# EAGLE schematic LED's (EAGLE 9.5.2)
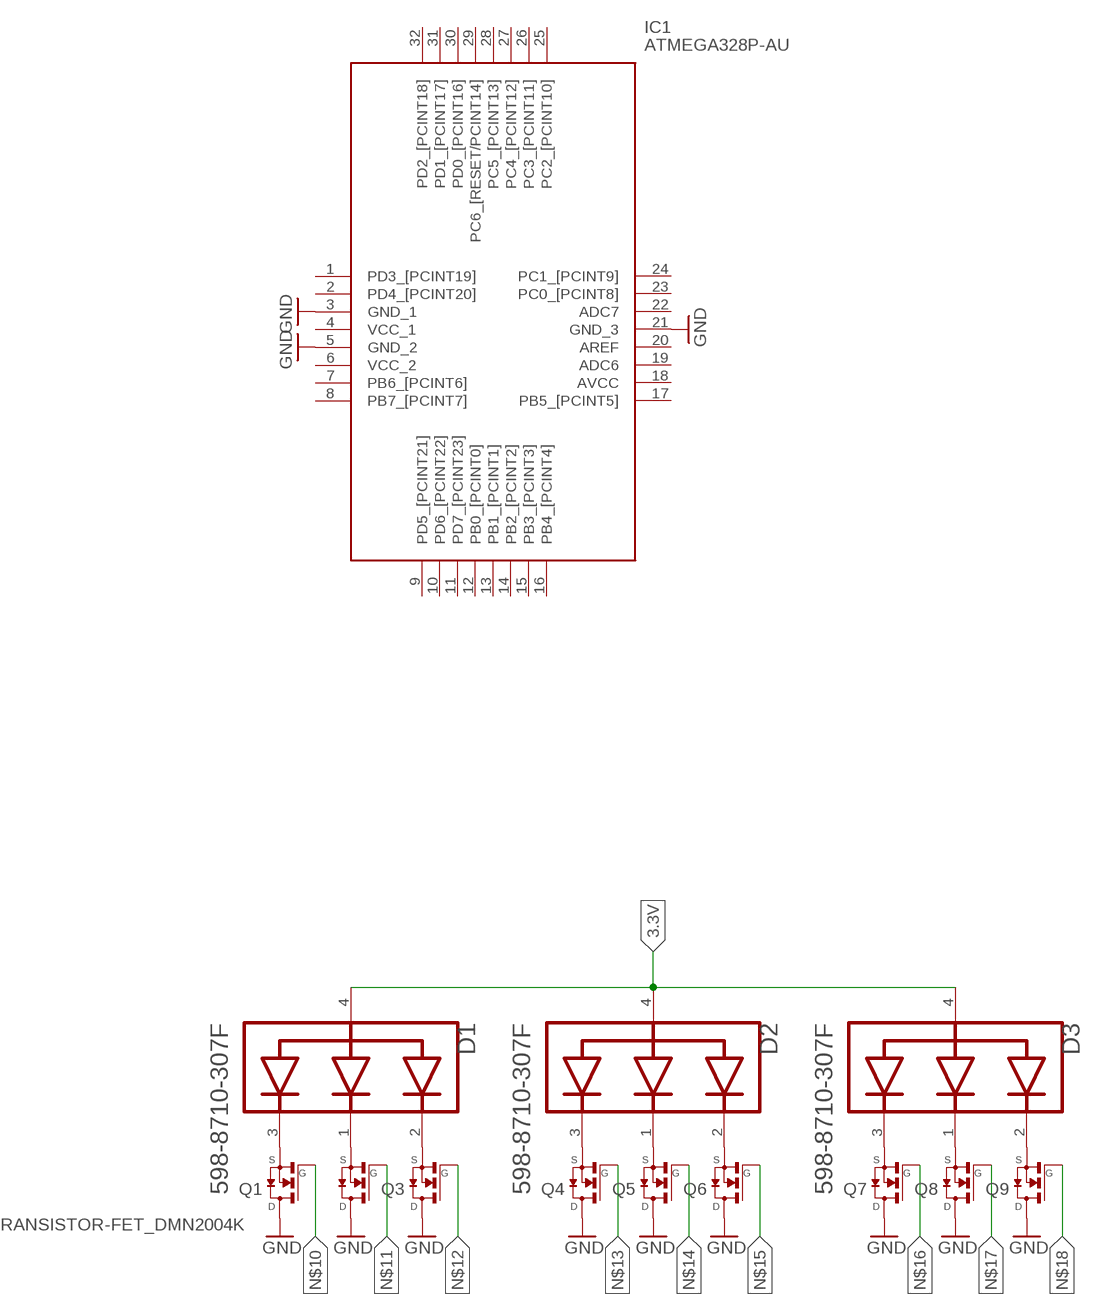
[diagram p0: schematic, sheet 1]

## Parts
D1  DIALIGHT_598-8710-307FDIALIGHT_598-8710-307F_0_0  [DIALIGHT_598-8710-307F_0]
D2  DIALIGHT_598-8710-307FDIALIGHT_598-8710-307F_0_0  [DIALIGHT_598-8710-307F_0]
D3  DIALIGHT_598-8710-307FDIALIGHT_598-8710-307F_0_0  [DIALIGHT_598-8710-307F_0]
IC1  ATMEGA328P-AU  [QFP80P900X900X120-32N]
Q1  TRANSISTOR-FET_DMN2004K  [TRANSISTOR-FET_SOT23]
Q2  TRANSISTOR-FET_DMN2004K  [TRANSISTOR-FET_SOT23]
Q3  TRANSISTOR-FET_DMN2004K  [TRANSISTOR-FET_SOT23]
Q4  TRANSISTOR-FET_DMN2004K  [TRANSISTOR-FET_SOT23]
Q5  TRANSISTOR-FET_DMN2004K  [TRANSISTOR-FET_SOT23]
Q6  TRANSISTOR-FET_DMN2004K  [TRANSISTOR-FET_SOT23]
Q7  TRANSISTOR-FET_DMN2004K  [TRANSISTOR-FET_SOT23]
Q8  TRANSISTOR-FET_DMN2004K  [TRANSISTOR-FET_SOT23]
Q9  TRANSISTOR-FET_DMN2004K  [TRANSISTOR-FET_SOT23]

## Nets
3.3V: D1.4(COMMON_ANODE) D2.4(COMMON_ANODE) D3.4(COMMON_ANODE)
GND: IC1.3(GND_1) IC1.5(GND_2) IC1.21(GND_3) Q1.3(D) Q2.3(D) Q3.3(D) Q4.3(D) Q5.3(D) Q6.3(D) Q7.3(D) Q8.3(D) Q9.3(D)
N$1: D1.3(BLUE_CATHODE) Q1.2(S)
N$2: D1.1(GREEN_CATHODE) Q2.2(S)
N$3: D1.2(RED_CATHODE) Q3.2(S)
N$4: D2.3(BLUE_CATHODE) Q4.2(S)
N$5: D2.1(GREEN_CATHODE) Q5.2(S)
N$6: D2.2(RED_CATHODE) Q6.2(S)
N$7: D3.3(BLUE_CATHODE) Q7.2(S)
N$8: D3.1(GREEN_CATHODE) Q8.2(S)
N$9: D3.2(RED_CATHODE) Q9.2(S)
N$10: Q1.1(G)
N$11: Q2.1(G)
N$12: Q3.1(G)
N$13: Q4.1(G)
N$14: Q5.1(G)
N$15: Q6.1(G)
N$16: Q7.1(G)
N$17: Q8.1(G)
N$18: Q9.1(G)
Unconnected: IC1.1(PD3_[PCINT19]) IC1.2(PD4_[PCINT20]) IC1.7(PB6_[PCINT6]) IC1.8(PB7_[PCINT7]) IC1.9(PD5_[PCINT21]) IC1.10(PD6_[PCINT22]) IC1.11(PD7_[PCINT23]) IC1.12(PB0_[PCINT0]) IC1.13(PB1_[PCINT1]) IC1.14(PB2_[PCINT2]) IC1.15(PB3_[PCINT3]) IC1.16(PB4_[PCINT4]) IC1.17(PB5_[PCINT5]) IC1.19(ADC6) IC1.20(AREF) IC1.22(ADC7) IC1.23(PC0_[PCINT8]) IC1.24(PC1_[PCINT9]) IC1.25(PC2_[PCINT10]) IC1.26(PC3_[PCINT11]) IC1.27(PC4_[PCINT12]) IC1.28(PC5_[PCINT13]) IC1.29(PC6_[RESET/PCINT14]) IC1.30(PD0_[PCINT16]) IC1.31(PD1_[PCINT17]) IC1.32(PD2_[PCINT18])

## Power pins joined to a net without a drawn wire
AVCC: IC1.18(AVCC)
VCC_1: IC1.4(VCC_1)
VCC_2: IC1.6(VCC_2)

## Library data of the parts
D1-D3 = Dialight - 598-8710-307F:DIALIGHT_598-8710-307F: Micro LED; CENTROID_NOT_SPECIFIED: No; DATASHEET: https://media.digikey.com/pdf/Data%20Sheets/Dialight%20PDFs/598_Series_0606_Pkg.pdf; DIGIKEY_DESCRIPTION: DIODE LED RGB CLEAR 0606 SMD; DIGIKEY_PART_NUMBER: 350-2096-1-ND; LEAD_FREE: yes; MF: Dialight; MOUSER_PART_NUMBER: 645-598-8710-307F; MPN: 598-8710-307F; PACKAGE: LED_SMD; PREFIX: D; ROHS: yes; TEMPERATURE_RANGE_HIGH: +100°C; TEMPERATURE_RANGE_LOW: -40°C
IC1 = ATMEGA328P-AU:ATMEGA328P-AU: MICROCHIP - ATMEGA328P-AU. - MICROCONTROLLER MCU, 8 BIT, ATMEGA, 20MHZ, TQFP-32 Source: Datasheet <https://componentsearchengine.com/Datasheets/2/ATMEGA328P-AU.pdf>; DESCRIPTION: MICROCHIP - ATMEGA328P-AU. - MICROCONTROLLER MCU, 8 BIT, ATMEGA, 20MHZ, TQFP-32; HEIGHT: 1.2mm; MANUFACTURER_NAME: Microchip; MANUFACTURER_PART_NUMBER: ATMEGA328P-AU; MOUSER_PART_NUMBER: 556-ATMEGA328P-AU; MOUSER_PRICE-STOCK: https://www.mouser.com/Search/Refine.aspx?Keyword=556-ATMEGA328P-AU; RS_PART_NUMBER: 1310271P; RS_PRICE-STOCK: http://uk.rs-online.com/web/p/products/1310271P
Q1-Q9 = 52101-101-REV-A:TRANSISTOR-FET_DMN2004K: N-Channel Enhancement MOSFET